# EAGLE design ultravision (EAGLE 6.1)
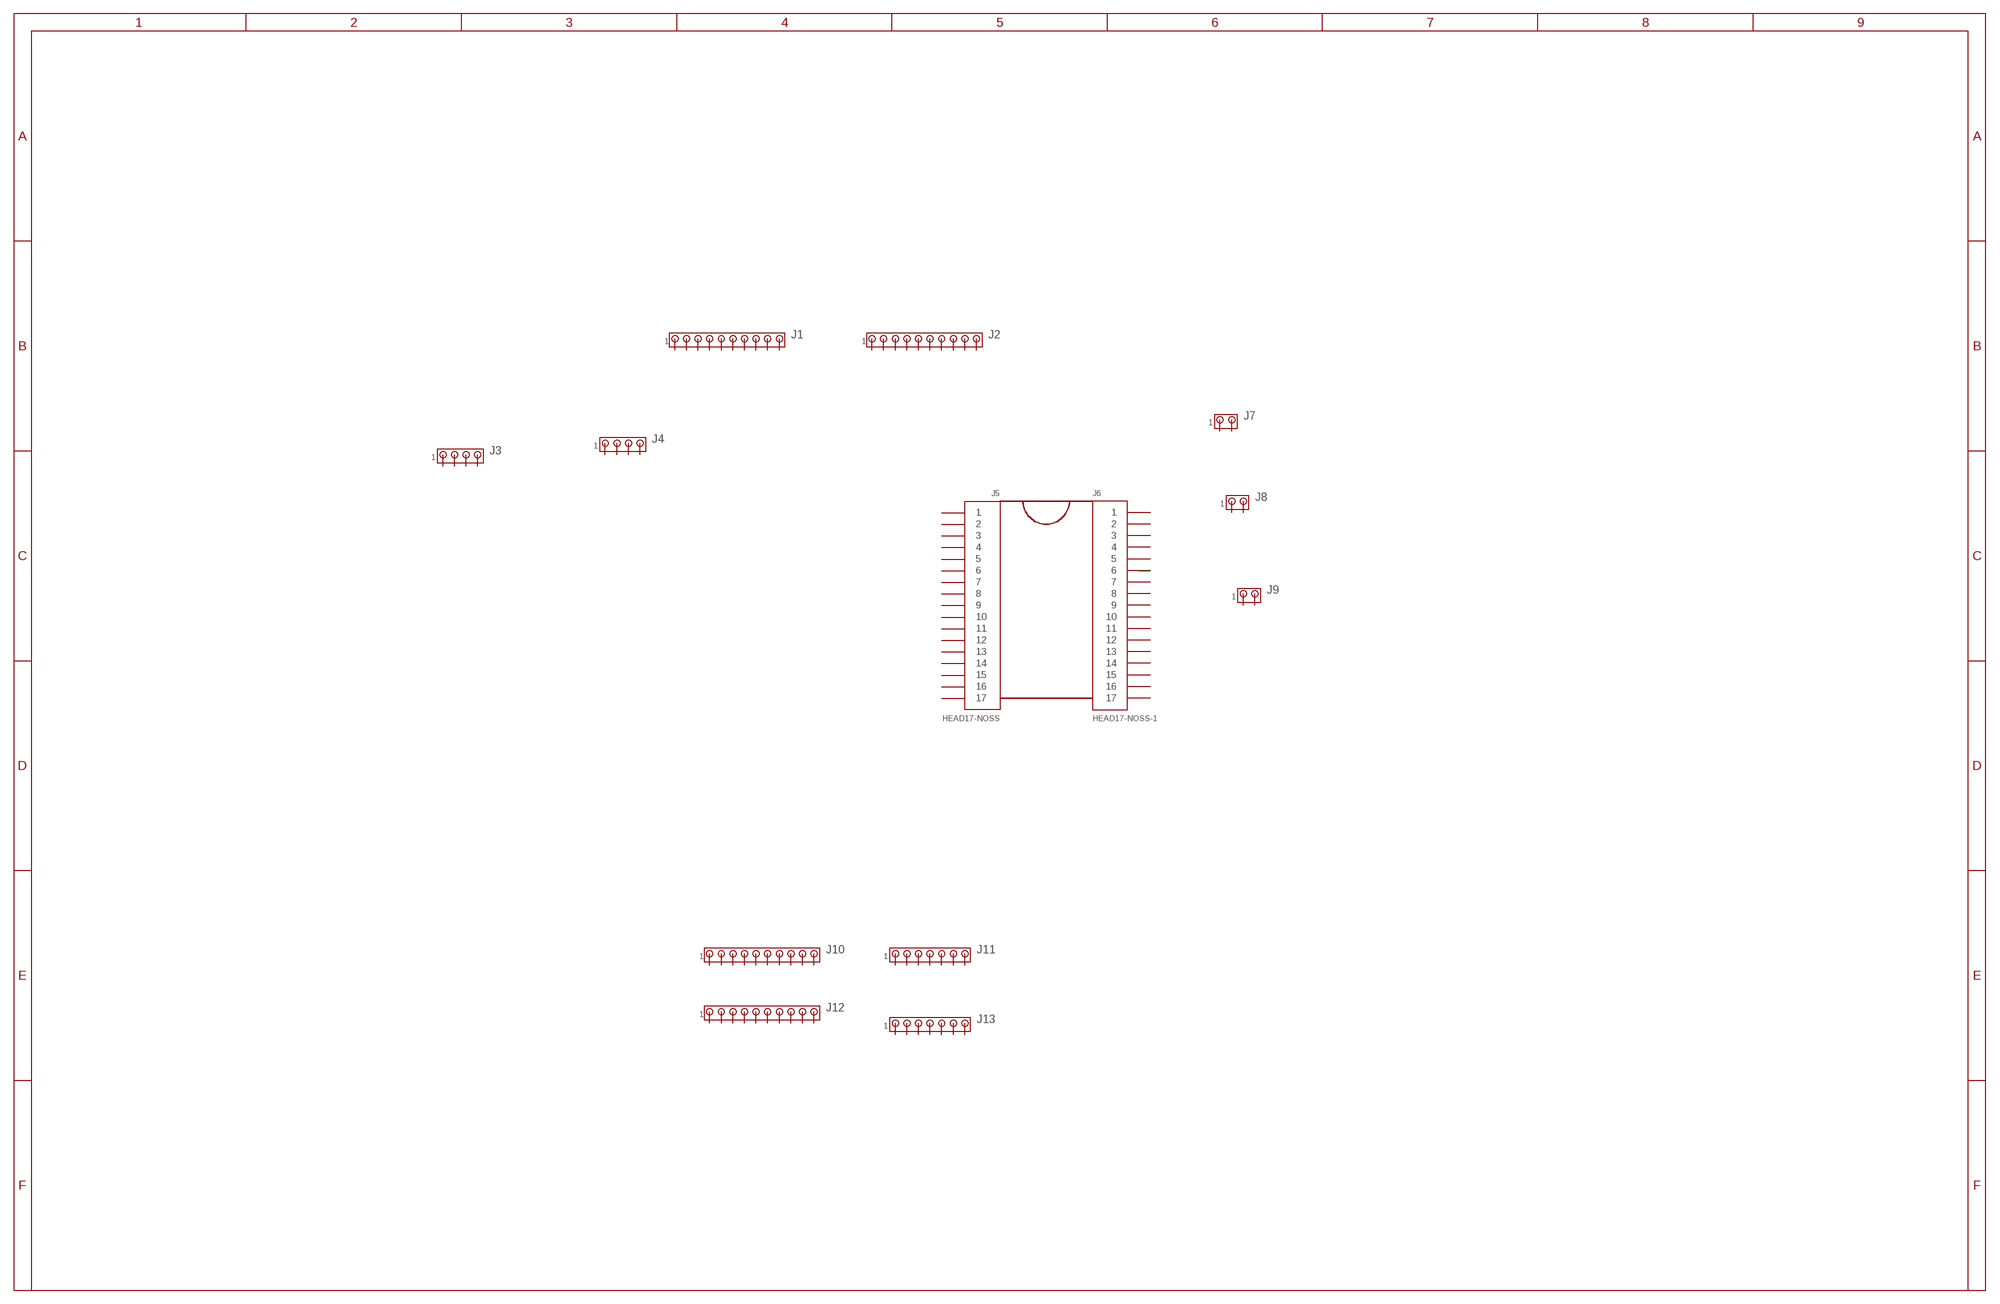
[diagram p0: schematic, sheet 1]

## Parts
J1  MTA10-100  [10X10MTA]
J2  MTA10-100  [10X10MTA]
J3  MTA04-100  [10X04MTA]
J4  MTA04-100  [10X04MTA]
J5  HEAD17-NOSS  [HEAD17-NOSS]
J6  HEAD17-NOSS-1  [HEAD17-NOSS-1]
J7  MTA02-100  [10X02MTA]
J8  MTA02-100  [10X02MTA]
J9  MTA02-100  [10X02MTA]
J10  MTA10-100  [10X10MTA]
J11  MTA07-100  [10X07MTA]
J12  MTA10-100  [10X10MTA]
J13  MTA07-100  [10X07MTA]

## Nets
N$2: J6.6
Unconnected: J1.1 J1.2 J1.3 J1.4 J1.5 J1.6 J1.7 J1.8 J1.9 J1.10 J2.1 J2.2 J2.3 J2.4 J2.5 J2.6 J2.7 J2.8 J2.9 J2.10 J3.1 J3.2 J3.3 J3.4 J4.1 J4.2 J4.3 J4.4 J5.1 J5.2 J5.3 J5.4 J5.5 J5.6 J5.7 J5.8 J5.9 J5.10 J5.11 J5.12 J5.13 J5.14 J5.15 J5.16 J5.17 J6.1 J6.2 J6.3 J6.4 J6.5 J6.7 J6.8 J6.9 J6.10 J6.11 J6.12 J6.13 J6.14 J6.15 J6.16 J6.17 J7.1 J7.2 J8.1 J8.2 J9.1 J9.2 J10.1 J10.2 J10.3 J10.4 J10.5 J10.6 J10.7 J10.8 J10.9 J10.10 J11.1 J11.2 J11.3 J11.4 J11.5 J11.6 J11.7 J12.1 J12.2 J12.3 J12.4 J12.5 J12.6 J12.7 J12.8 J12.9 J12.10 J13.1 J13.2 J13.3 J13.4 J13.5 J13.6 J13.7

## Library data of the parts
J1 J2 J10 J12 = con-amp:MTA10-100: AMP connector
J3 J4 = con-amp:MTA04-100: AMP connector
J5 = SmartPrj:HEAD17-NOSS
J6 = SmartPrj:HEAD17-NOSS-1
J7-J9 = con-amp:MTA02-100: AMP connector
J11 J13 = con-amp:MTA07-100: AMP connector

## Net classes
0 default: width 0.254 mm, drill 0.61 mm, clearance 0.203 mm

## Board
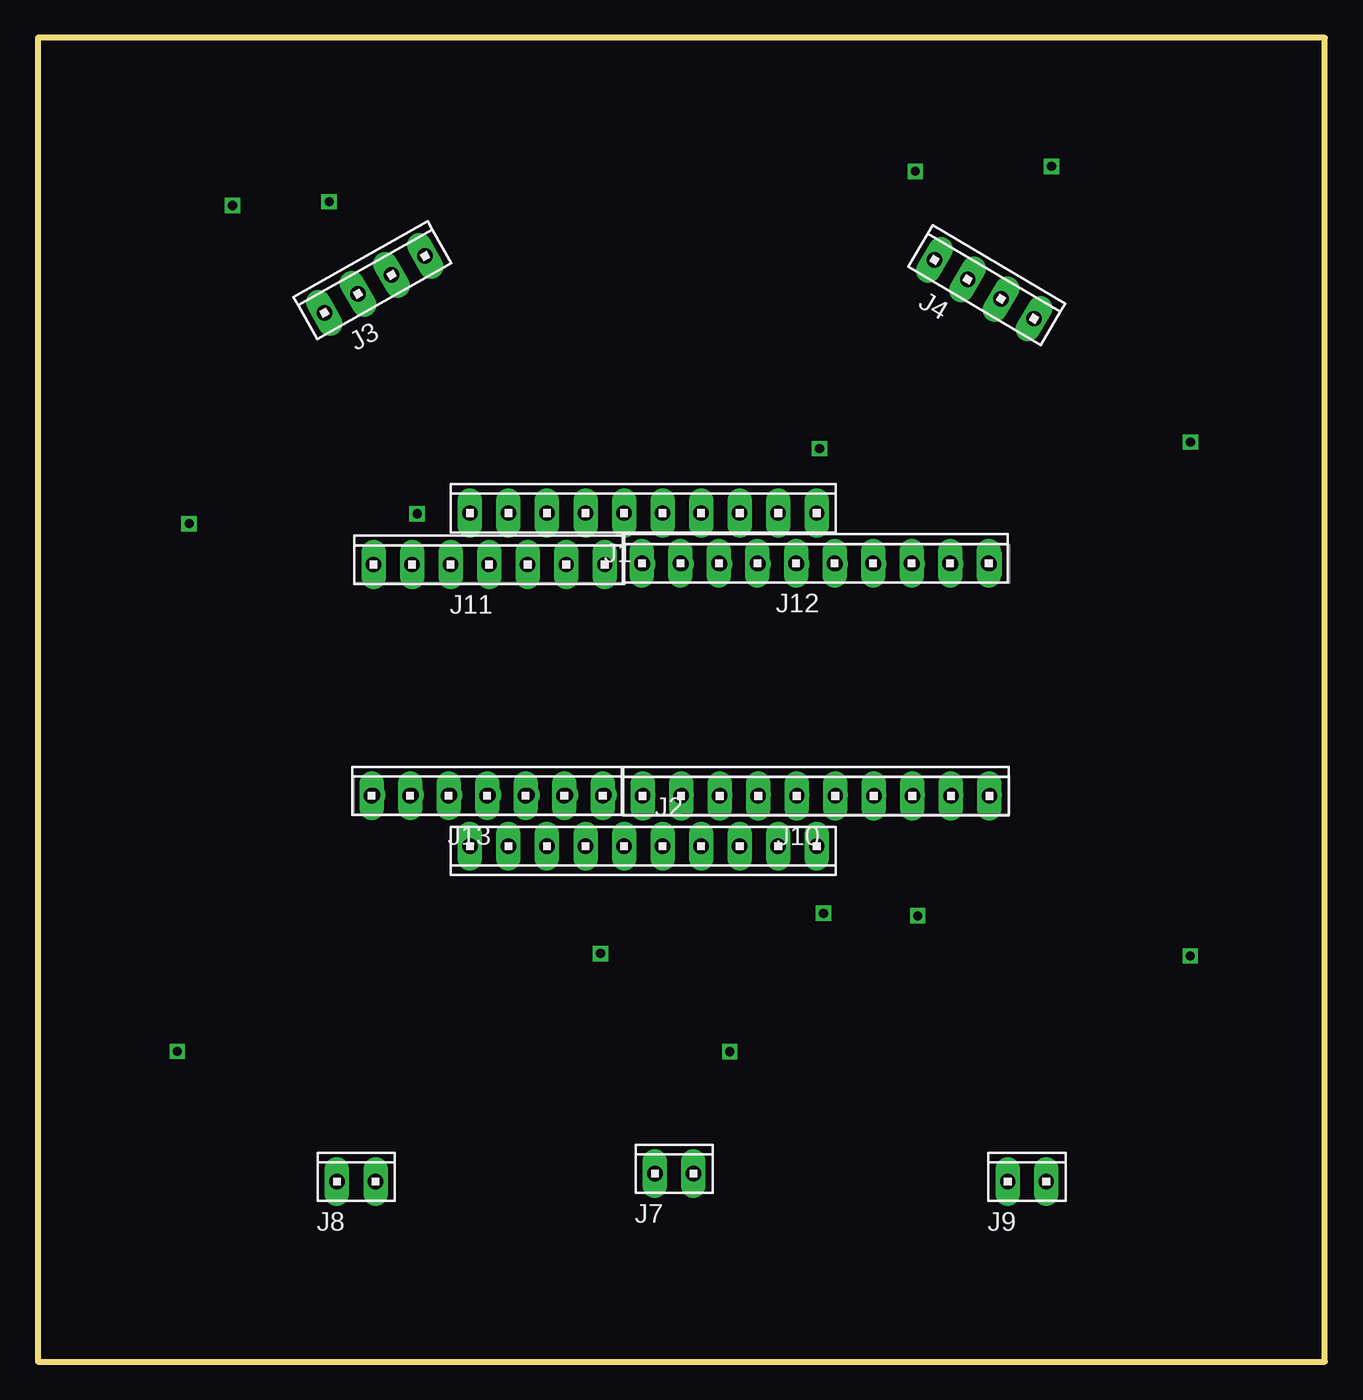
[diagram p1: board, top side]
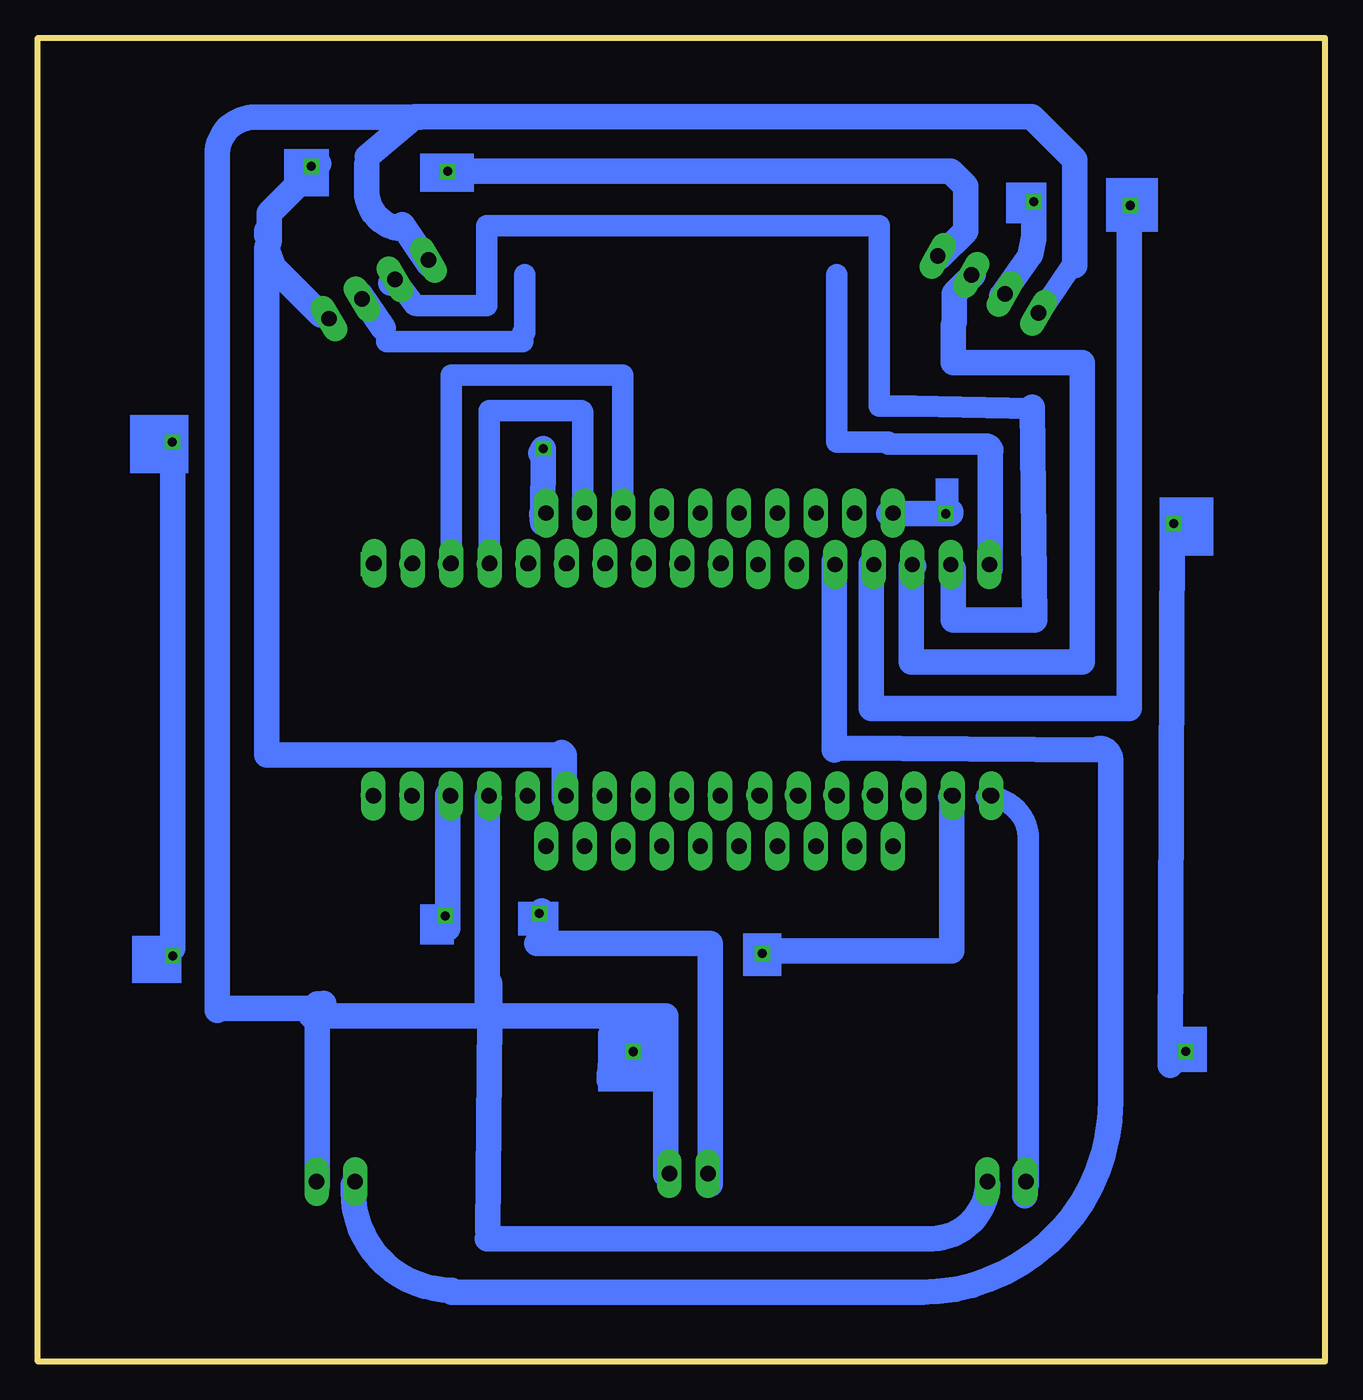
[diagram p2: board, bottom side, seen from below]

Size 84.84 x 87.28 mm. Coordinates in mm from the lower left corner, seen from the top.
Outline: 0,77.99 0,0 84.83,0 84.83,87.28 0,87.28 0,78.52 0,77.99
Copper layers (1*2+15*16): Top 0.035mm / dielectric 0.5mm / POWER 0.035mm / dielectric 0.4mm / GROUND 0.035mm / dielectric 0.5mm / Bottom 0.035mm
Design rules: minimum track width 8mil, minimum drill 18mil, track to track 8mil, track to pad 8mil, pad to pad 8mil, via to via 8mil, smd to smd 7mil, copper to edge 8mil, drill to drill 8mil, minimum pad ring 12mil, minimum via ring 8mil, stop-mask expansion 1mil, vias tented up to drill 20mil, thermal gap 14mil

### Footprints (pad centres in the part's own frame; a part is rotated, then mirrored left to right if it is on the bottom)
10X10MTA = drill 1.016 long: 1 11.43,0; 2 8.89,0; 3 6.35,0; 4 3.81,0; 5 1.27,0; 6 -1.27,0; 7 -3.81,0; 8 -6.35,0; 9 -8.89,0; 10 -11.43,0
10X04MTA = drill 1.016 long: 1 3.81,0; 2 1.27,0; 3 -1.27,0; 4 -3.81,0
HEAD17-NOSS = drill 0.914 pad 1.575 square: 1 0,0 | drill 0.914 pad 1.575: 2 2.54,0; 3 5.08,0; 4 7.62,0; 5 10.16,0; 6 12.7,0; 7 15.24,0; 8 17.78,0; 9 20.32,0; 10 22.86,0; 11 25.4,0; 12 27.94,0; 13 30.48,0; 14 33.02,0; 15 35.56,0; 16 38.1,0; 17 40.64,0
HEAD17-NOSS-1 = drill 0.914 pad 1.575: 1 0,0; 2 2.54,0; 3 5.08,0; 4 7.62,0; 5 10.16,0; 6 12.7,0; 7 15.24,0; 8 17.78,0; 9 20.32,0; 10 22.86,0; 11 25.4,0; 12 27.94,0; 13 30.48,0; 14 33.02,0; 15 35.56,0; 16 38.1,0; 17 40.64,0
10X02MTA = drill 1.016 long: 1 1.27,0; 2 -1.27,0
10X07MTA = drill 1.016 long: 1 7.62,0; 2 5.08,0; 3 2.54,0; 4 0,0; 5 -2.54,0; 6 -5.08,0; 7 -7.62,0

### Placement (x,y rotation side)
J1  39.91,55.95 0 top
J2  39.91,33.98 180 top
J3  22.2,71.03 29.4 top
J4  62.38,70.71 329.4 top
J5  62.76,52.59 180 top
J6  62.76,37.35 180 top
J7  41.94,12.39 0 top
J8  20.98,11.87 0 top
J9  65.2,11.86 0 top
J10  51.29,37.3 0 top
J11  29.74,52.56 0 top
J12  51.24,52.65 0 top
J13  29.61,37.32 0 top

### Tracks (layer width: path | path; a pad name or v marks a point on that pad's centre or on a via)
N$1
  Bottom 1.676: 16.47,72.28 16.47,79.25 19.32,82.1 59.99,82.1 63.14,79.44
N$3  (via drill 0.6)
  Bottom 1.676: 25.48,72.76 23.69,74.55 23.69,77.5 24.67,78.49 v57.82,78.49 57.99,78.49
N$4
  Bottom 1.676: 66.32,78.98 69.58,75.71 69.58,73.9 69.75,73.41 69.26,72.1 66.15,69 66.15,68.99
N$5
  Bottom 1.676: 51.94,27.56 40.51,27.56 40.51,11.67
N$6  (via drill 0.6)
  other vias: 66.81,78.81
N$7
  Bottom 1.676: 55.08,37.17 55.21,37.24 55.21,23.51
N$8
  Bottom 1.676: 19.79,10.93 19.79,12.52
N$9
  Bottom 1.676: 26.5,4.57 57.57,4.57
N$10
  Bottom 1.676: 66.41,11.57 66.41,23.6
N$11
  Bottom 1.676: 22.23,11.65 arc90 26.22,8.11 55.21,8.11
N$12
  Bottom 1.676: 69.75,74.56 69.75,74.23
N$13
  Bottom 1.676: 57.82,37.41 57.82,28.58
N$14
  Bottom 1.676: 51.62,27.92 51.62,29.72
N$15  (via drill 0.6)
  other vias: 51.78,29.56
N$16  (via drill 0.6)
  other vias: 57.99,29.4
N$17
  Bottom 1.422: 52.74,71.68 52.74,67.85 52.88,67.85 52.88,67.26 61.84,67.26 61.84,67.41
N$18
  Bottom 1.676: 22.05,52.3 22.05,60.16
N$19
  Bottom 1.676: 24.5,52.3 24.5,48.91 19.13,48.91 19.28,62.94
N$20
  Bottom 1.676: 61.58,71.12 61.26,71.12
N$21
  Bottom 1.676: 62.07,68.15 63.62,70.44
N$22
  Bottom 1.676: 27.12,52.46 27.28,52.46 27.28,46.13 16.01,46.13 16.01,65.88 24.5,65.88 24.5,68.34
N$23
  Bottom 1.676: 29.89,52.63 29.89,43.07 12.91,43.07 12.91,76.36
N$24  (via drill 0.6)
  Bottom 1.676: 19.19,76.6 v19.19,76.48 19.19,73.99
N$25
  Bottom 1.422: 60.01,69.68 61.55,71.74
N$26
  Bottom 1.676: 19.19,74.11 19.44,72.97 21.32,70.27
N$27
  Bottom 1.676: 24.42,68.56 24.42,70.44 23.2,71.66
N$28  (via drill 0.6)
  other vias: 12.82,76.24
N$29
  Bottom 1.676: 50.15,37.06 50.15,40.01 50.31,40.18
N$30
  Bottom 1.676: 50.64,40.01 69.75,40.01 69.75,73.27
N$31
  Bottom 1.676: 72.69,23.3 65.99,23.3 65.99,23.63
N$32
  Bottom 1.676: 14.69,40.33 32.32,40.48
N$33
  Bottom 1.676: 43.45,12.33 43.45,22.81 54.88,22.81 55.05,22.81 | 55.05,22.81 55.05,24.94 | 66.81,22.81 55.05,22.81
N$34
  Bottom 1.676: 55.19,8.61 55.05,22.65
N$35  (via drill 0.6)
  Bottom 1.676: 28.75,55.9 v24.99,55.9 24.67,55.9 24.67,56.07
N$36
  Bottom 1.676: 10.05,55.26 10.19,19.79 10.19,19.52
N$37  (via drill 0.6)
  other vias: 45.61,20.44
N$38  (via drill 0.6)
  other vias: 9.18,20.46
N$39  (via drill 0.6)
  other vias: 9.97,55.25
N$40  (via drill 0.6)
  Bottom 1.676: 24.67,37.23 24.61,37.08 24.61,27.07 37.08,27.07 v37.08,26.91
N$41
  Bottom 1.676: 75.95,27.23 75.95,60.96
N$42  (via drill 0.6)
  Bottom 1.676: 51.7,59.91 v51.52,60.21 51.54,55.28 51.62,55.9
N$43  (via drill 0.6)
  other vias: 75.96,26.74
N$44  (via drill 0.6)
  other vias: 75.97,60.63
N$45
  Bottom 1.422: 21.89,60.05 arc-90 22.33,60.49 28.8,60.49
N$46
  Bottom 1.422: 27.18,63 29.38,63 29.38,74.92 55.23,74.92 55.23,69.62 59.79,69.62
N$47
  Bottom 1.422: 55.01,52.25 arc-90 55.09,52.55 55.09,62.7 49.07,62.7 arc90 48.92,62.55 48.92,55.64
N$48
  Bottom 1.422: 19.25,62.85 27.03,63
N$49
  Bottom 1.422: 28.8,60.64 32.17,60.64 32.17,71.68
N$50
  Bottom 1.422: 57.66,52.4 57.58,52.55 57.58,65.06 46.27,65.06 46.27,55.49
N$51
  Bottom 1.422: 16.75,72.18 19.1,68.72
N$52
  Bottom 1.422: 22.33,37.24 arc90 19.54,34.45 19.54,11.63
N$53
  Bottom 1.422: 43.92,18.67 47.3,18.52 47.16,20.73 | 44.66,22.65 44.51,18.96 45.98,18.82 45.98,22.06 47.16,22.06 47.16,20.73 | 47.16,20.73 47.16,18.82 | 47.16,20.73 46.57,18.96
N$54
  Bottom 1.422: 47.01,19.99 47.3,18.96
N$55
  Bottom 1.676: 26.68,4.57 arc-90 14.13,17.11 14.13,35.57 14.13,36.75 14.13,39.7 arc-90 14.87,40.44
N$56
  Bottom 1.676: 64.05,11.65 64.05,11.19 arc-90 57.57,4.71
N$57
  Bottom 1.676: 32.34,40.34 32.34,52.79
N$58
  Bottom 1.676: 59.63,82.07 70.53,82.07 arc-90 73.03,79.56 73.03,23.17
N$59
  Bottom 1.676: 59.04,72.32 60.81,74.98
N$60
  Bottom 1.676: 60.66,74.69 arc90 63.16,77.19 63.16,78.97
(copper drawn outside any net)
  shapes: Bottom area x13